# Altium project forwardConverterPCB.PrjPcb (part 8 of 22)
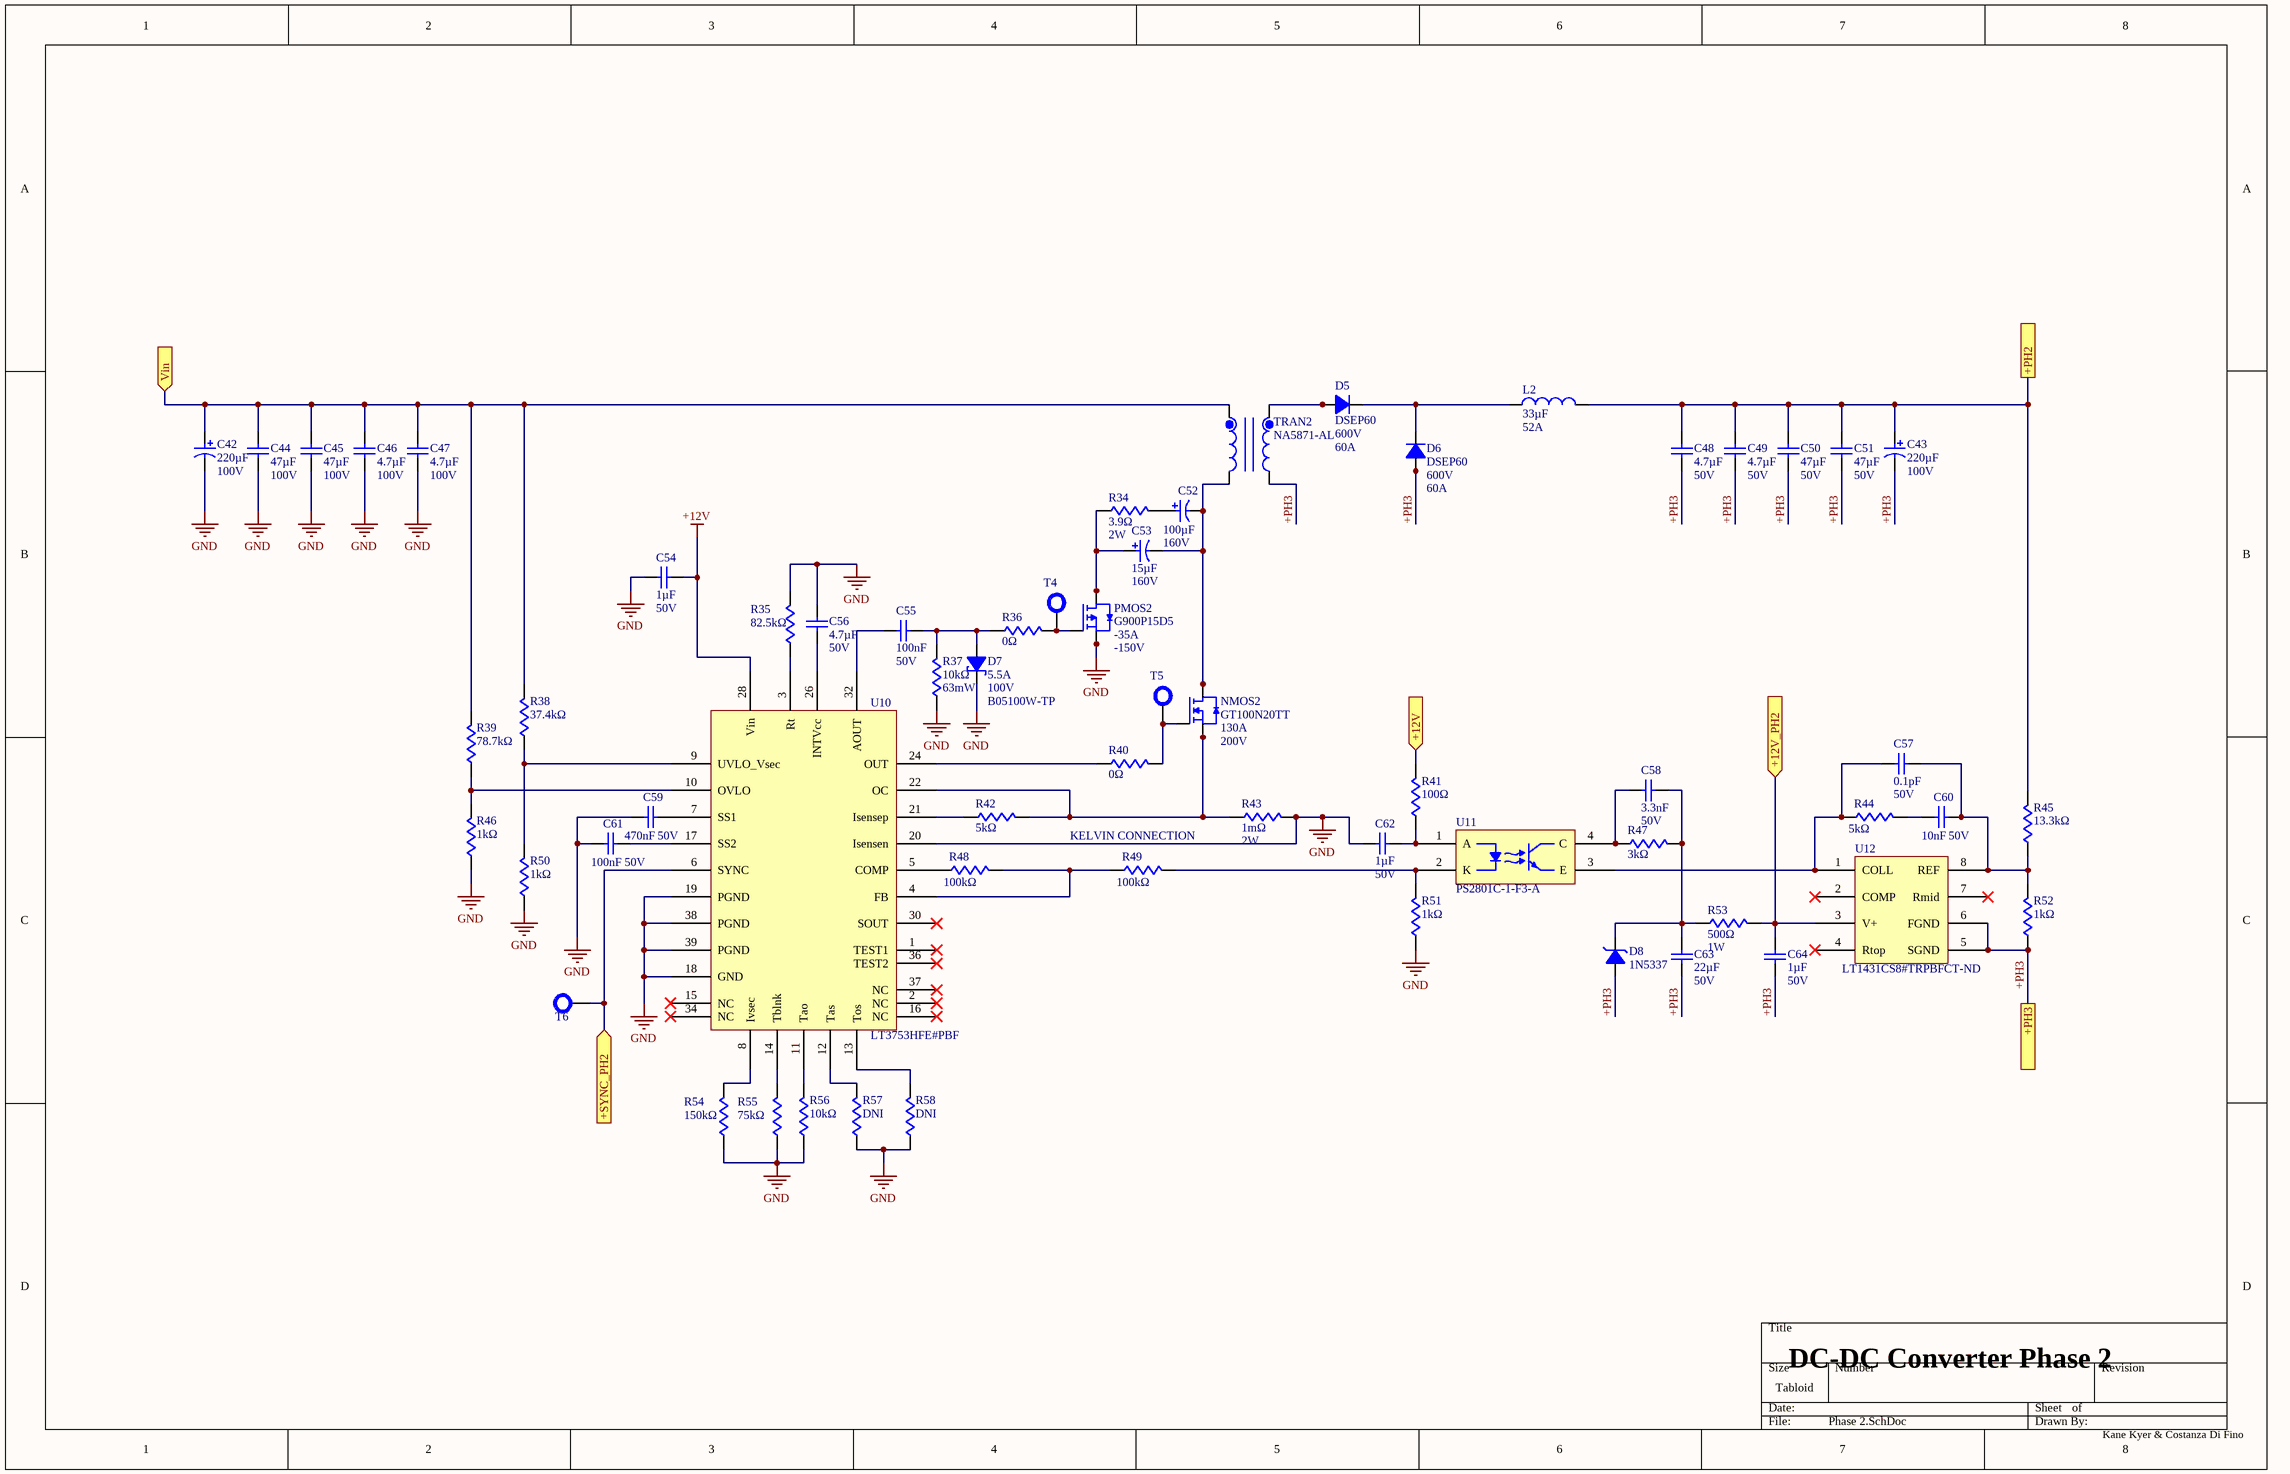
[diagram p13: Phase 2.SchDoc]

## Sheet Phase 2.SchDoc (continued)

### Library data of the parts (continued)
C60 = C0603C103K5RACTU: Capacitor, Multilayer, Ceramic, 50V, 10%, X7R, 15% Tc, 0.01Uf, Surface Mount, 0603; Manufacturer: KEMET; Dissipation Factor: 2.5%; Temperature Coefficient: 30ppm/°C; Supplier: DigiKey; Supplier Part Number: 399-C0603C103K5RACTUCT-ND; Manufacturer Part Number: C0603C103K5RACTU; RoHS: Compliant; Category: Ceramic Capacitors; Stock: 5424360; Pricing: 1=0.08, 10=0.009 (USD); Case/Package: 0603; Case Code (Imperial): 0603; China RoHS: Compliant; Contact Plating: Tin; Country of Origin: Mainland China, Mexico; Depth: 800µm; Dielectric: X7R; Dielectric Material: Ceramic; Export Control Classification Number (ECCN) Code: EAR99; Height: 800µm; Harmonized Tariff Schedule (HTS) Code: 8532.24.00.20; Introduction Date: 2011-07-27; Lead Free: Lead Free; Lead Pitch: 700µm; Length: 1.6mm; Lifecycle Status: Production; Material: Ceramic; Max Operating Temperature: 125°C; Min Operating Temperature: -55°C; Mounting Technology: Surface Mount; Pins: 2; Number of Terminals: 2; Packaging: Cut Tape; Radiation Hardening: No; REACH SVHC: Yes; Schedule B: 8532240020, 8532240020|8532240020, 8532240020|8532240020|8532240020, 8532240020|8532240020|8532240020|8532240020; Termination: SMD/SMT; Thickness: 863.6µm; Tolerance: 10%; Voltage: 50V; Voltage Rating (DC): 50V; Width: 800µm; ComponentLink1URL: https://datasheet.octopart.com:443/C0603C103K5RACTU-KEMET-datasheet-178445679.pdf?src-supplier=Farnell; ComponentLink1Description: https://datasheet.octopart.com:443/C0603C103K5RACTU-KEMET-datasheet-178445679.pdf?src-supplier=Farnell; ComponentLink2URL: https://datasheet.octopart.com:443/C0603C103K5RACTU-KEMET-datasheet-137357759.pdf?src-supplier=Farnell; ComponentLink2Description: https://datasheet.octopart.com:443/C0603C103K5RACTU-KEMET-datasheet-137357759.pdf?src-supplier=Farnell; ComponentLink3URL: https://datasheet.octopart.com:443/C0603C103K5RACTU-KEMET-datasheet-149521831.pdf?src-supplier=Farnell; ComponentLink3Description: https://datasheet.octopart.com:443/C0603C103K5RACTU-KEMET-datasheet-149521831.pdf?src-supplier=Farnell; ComponentLink4URL: https://datasheet.octopart.com:443/C0603C103K5RAC-TU-Kemet-datasheet-12608295.pdf?src-supplier=Farnell; ComponentLink4Description: https://datasheet.octopart.com:443/C0603C103K5RAC-TU-Kemet-datasheet-12608295.pdf?src-supplier=Farnell; ComponentLink5URL: https://datasheet.octopart.com:443/C0603C103K5RAC-TU-Kemet-datasheet-11992184.pdf?src-supplier=Farnell; ComponentLink5Description: https://datasheet.octopart.com:443/C0603C103K5RAC-TU-Kemet-datasheet-11992184.pdf?src-supplier=Farnell; ComponentLink6URL: https://datasheet.octopart.com:443/C0603C103K5RAC-TU-Kemet-datasheet-10942409.pdf?src-supplier=Farnell; ComponentLink6Description: https://datasheet.octopart.com:443/C0603C103K5RAC-TU-Kemet-datasheet-10942409.pdf?src-supplier=Farnell; ComponentLink7URL: https://datasheet.octopart.com:443/C0603C103K5RAC-TU-Kemet-datasheet-10404442.pdf?src-supplier=Farnell; ComponentLink7Description: https://datasheet.octopart.com:443/C0603C103K5RAC-TU-Kemet-datasheet-10404442.pdf?src-supplier=Farnell; ComponentLink8URL: https://datasheet.octopart.com:443/C0603C103K5RACTU-KEMET-datasheet-101575646.pdf?src-supplier=Farnell; ComponentLink8Description: https://datasheet.octopart.com:443/C0603C103K5RACTU-KEMET-datasheet-101575646.pdf?src-supplier=Farnell; ComponentLink9URL: https://datasheet.octopart.com:443/C0603C103K5RACTU.-Kemet-datasheet-41232427.pdf?src-supplier=Farnell; ComponentLink9Description: https://datasheet.octopart.com:443/C0603C103K5RACTU.-Kemet-datasheet-41232427.pdf?src-supplier=Farnell; ComponentLink10URL: https://datasheet.octopart.com:443/C0603C103K5RACTU-KEMET-datasheet-176142155.pdf?src-supplier=Farnell; ComponentLink10Description: https://datasheet.octopart.com:443/C0603C103K5RACTU-KEMET-datasheet-176142155.pdf?src-supplier=Farnell; ComponentLink11URL: https://datasheet.octopart.com:443/C0603C103K5RAC-TU-Kemet-datasheet-7833651.pdf?src-supplier=Farnell; ComponentLink11Description: https://datasheet.octopart.com:443/C0603C103K5RAC-TU-Kemet-datasheet-7833651.pdf?src-supplier=Farnell; ComponentLink12URL: https://datasheet.octopart.com:443/C0603C103K5RAC-TU-Kemet-datasheet-7601896.pdf?src-supplier=Farnell; ComponentLink12Description: https://datasheet.octopart.com:443/C0603C103K5RAC-TU-Kemet-datasheet-7601896.pdf?src-supplier=Farnell; ComponentLink13URL: https://datasheet.octopart.com:443/C0603C103K5RAC-TU-Kemet-datasheet-5316294.pdf?src-supplier=Farnell; ComponentLink13Description: https://datasheet.octopart.com:443/C0603C103K5RAC-TU-Kemet-datasheet-5316294.pdf?src-supplier=Farnell; ComponentLink14URL: https://datasheet.octopart.com:443/C0603C103K5RAC-TU-Kemet-datasheet-5314837.pdf?src-supplier=Farnell; ComponentLink14Description: https://datasheet.octopart.com:443/C0603C103K5RAC-TU-Kemet-datasheet-5314837.pdf?src-supplier=Farnell; ComponentLink15URL: https://datasheet.octopart.com:443/C0603C103K5RAC-TU-Kemet-datasheet-8092359.pdf?src-supplier=Farnell; ComponentLink15Description: https://datasheet.octopart.com:443/C0603C103K5RAC-TU-Kemet-datasheet-8092359.pdf?src-supplier=Farnell; ComponentLink16URL: https://datasheet.octopart.com:443/C0603C103K5RACTU-Kemet-datasheet-5314449.pdf?src-supplier=Farnell; ComponentLink16Description: https://datasheet.octopart.com:443/C0603C103K5RACTU-Kemet-datasheet-5314449.pdf?src-supplier=Farnell; ComponentLink17URL: https://datasheet.octopart.com:443/C0603C103K5RAC-TU-Kemet-datasheet-5390537.pdf?src-supplier=Farnell; ComponentLink17Description: https://datasheet.octopart.com:443/C0603C103K5RAC-TU-Kemet-datasheet-5390537.pdf?src-supplier=Farnell; ComponentLink18URL: https://datasheet.octopart.com:443/C0603C103K5RAC-TU-Kemet-datasheet-5314969.pdf?src-supplier=Farnell; ComponentLink18Description: https://datasheet.octopart.com:443/C0603C103K5RAC-TU-Kemet-datasheet-5314969.pdf?src-supplier=Farnell; ComponentLink19URL: https://datasheet.octopart.com:443/C0603C103K5RAC-TU-Kemet-datasheet-5314627.pdf?src-supplier=Farnell; ComponentLink19Description: https://datasheet.octopart.com:443/C0603C103K5RAC-TU-Kemet-datasheet-5314627.pdf?src-supplier=Farnell; ComponentLink20URL: https://datasheet.octopart.com:443/C0603C103K5RAC-TU-Kemet-datasheet-5389132.pdf?src-supplier=Farnell; ComponentLink20Description: https://datasheet.octopart.com:443/C0603C103K5RAC-TU-Kemet-datasheet-5389132.pdf?src-supplier=Farnell; ComponentLink21URL: https://datasheet.octopart.com:443/C0603C103K5RAC-TU-Kemet-datasheet-5313836.pdf?src-supplier=Farnell; ComponentLink21Description: https://datasheet.octopart.com:443/C0603C103K5RAC-TU-Kemet-datasheet-5313836.pdf?src-supplier=Farnell; ComponentLink22URL: https://datasheet.octopart.com:443/C0603C103K5RAC-TU-Kemet-datasheet-8111010.pdf?src-supplier=Farnell; ComponentLink22Description: https://datasheet.octopart.com:443/C0603C103K5RAC-TU-Kemet-datasheet-8111010.pdf?src-supplier=Farnell; ComponentLink23URL: https://datasheet.octopart.com:443/C0603C103K5RAC-TU-Kemet-datasheet-7541751.pdf?src-supplier=Farnell; ComponentLink23Description: https://datasheet.octopart.com:443/C0603C103K5RAC-TU-Kemet-datasheet-7541751.pdf?src-supplier=Farnell; ComponentLink24URL: https://datasheet.octopart.com:443/C0603C103K5RAC-TU-Kemet-datasheet-7627733.pdf?src-supplier=Farnell; ComponentLink24Description: https://datasheet.octopart.com:443/C0603C103K5RAC-TU-Kemet-datasheet-7627733.pdf?src-supplier=Farnell; ComponentLink25URL: https://datasheet.octopart.com:443/C0603C103K5RAC-TU-Kemet-datasheet-5315946.pdf?src-supplier=Farnell; ComponentLink25Description: https://datasheet.octopart.com:443/C0603C103K5RAC-TU-Kemet-datasheet-5315946.pdf?src-supplier=Farnell; ComponentLink26URL: https://datasheet.octopart.com:443/C0603C103K5RAC7867-KEMET-datasheet-182039592.pdf?src-supplier=JRH+Electronics; ComponentLink26Description: https://datasheet.octopart.com:443/C0603C103K5RAC7867-KEMET-datasheet-182039592.pdf?src-supplier=JRH+Electronics; ComponentLink27URL: https://datasheet.octopart.com:443/C0603C103K5RACTU-KEMET-datasheet-137357764.pdf?src-supplier=Upverter; ComponentLink27Description: https://datasheet.octopart.com:443/C0603C103K5RACTU-KEMET-datasheet-137357764.pdf?src-supplier=Upverter; ComponentLink28URL: https://datasheet.octopart.com:443/C0603C103K5RAC7867-KEMET-datasheet-188512054.pdf?src-supplier=ODG+(Origin+Data+Global); ComponentLink28Description: https://datasheet.octopart.com:443/C0603C103K5RAC7867-KEMET-datasheet-188512054.pdf?src-supplier=ODG+(Origin+Data+Global); ComponentLink29URL: https://datasheet.octopart.com:443/C0603C103K5RACTU-Kemet-datasheet-5313890.pdf?src-supplier=element14; ComponentLink29Description: https://datasheet.octopart.com:443/C0603C103K5RACTU-Kemet-datasheet-5313890.pdf?src-supplier=element14; ComponentLink30URL: https://datasheet.octopart.com:443/C0603C103K5RACTU-KEMET-datasheet-157246124.pdf?src-supplier=Electro+Sonic; ComponentLink30Description: https://datasheet.octopart.com:443/C0603C103K5RACTU-KEMET-datasheet-157246124.pdf?src-supplier=Electro+Sonic; ComponentLink31URL: https://datasheet.octopart.com:443/C0603C103K5RACTU-KEMET-datasheet-32036385.pdf?src-supplier=Electro+Sonic; ComponentLink31Description: https://datasheet.octopart.com:443/C0603C103K5RACTU-KEMET-datasheet-32036385.pdf?src-supplier=Electro+Sonic; ComponentLink32URL: https://datasheet.octopart.com:443/C0603C103K5RACTU-KEMET-datasheet-176142164.pdf?src-supplier=Newark; ComponentLink32Description: https://datasheet.octopart.com:443/C0603C103K5RACTU-KEMET-datasheet-176142164.pdf?src-supplier=Newark; ComponentLink33URL: https://datasheet.octopart.com:443/C0603C103K5RACTU-Kemet-datasheet-27203261.pdf?src-supplier=Newark; ComponentLink33Description: https://datasheet.octopart.com:443/C0603C103K5RACTU-Kemet-datasheet-27203261.pdf?src-supplier=Newark; ComponentLink34URL: https://datasheet.octopart.com:443/C0603C103K5RACTU-KEMET-datasheet-164512540.pdf?src-supplier=TME; ComponentLink34Description: https://datasheet.octopart.com:443/C0603C103K5RACTU-KEMET-datasheet-164512540.pdf?src-supplier=TME; ComponentLink35URL: https://datasheet.octopart.com:443/C0603C103K5RACTU-KEMET-datasheet-81639432.pdf?src-supplier=TME; ComponentLink35Description: https://datasheet.octopart.com:443/C0603C103K5RACTU-KEMET-datasheet-81639432.pdf?src-supplier=TME; ComponentLink36URL: https://datasheet.octopart.com:443/C0603C103K5RACTU-KEMET-datasheet-68331906.pdf?src-supplier=TME; ComponentLink36Description: https://datasheet.octopart.com:443/C0603C103K5RACTU-KEMET-datasheet-68331906.pdf?src-supplier=TME; ComponentLink37URL: https://datasheet.octopart.com:443/C0603C103K5RACTU-KEMET-datasheet-110724412.pdf?src-supplier=RS+(Formerly+Allied+Electronics); ComponentLink37Description: https://datasheet.octopart.com:443/C0603C103K5RACTU-KEMET-datasheet-110724412.pdf?src-supplier=RS+(Formerly+Allied+Electronics); ComponentLink38URL: https://datasheet.octopart.com:443/C0603C103K5RACTU-Kemet-datasheet-464.pdf?src-supplier=RS+(Formerly+Allied+Electronics); ComponentLink38Description: https://datasheet.octopart.com:443/C0603C103K5RACTU-Kemet-datasheet-464.pdf?src-supplier=RS+(Formerly+Allied+Electronics); ComponentLink39URL: https://datasheet.octopart.com/C0603C103K5RACTU-KEMET-datasheet-84169754.pdf; ComponentLink39Description: https://datasheet.octopart.com/C0603C103K5RACTU-KEMET-datasheet-84169754.pdf; ComponentLink40URL: https://datasheet.octopart.com:443/C0603C103K5RACTU-Kemet-datasheet-22084244.pdf?src-supplier=element14+APAC; ComponentLink40Description: https://datasheet.octopart.com:443/C0603C103K5RACTU-Kemet-datasheet-22084244.pdf?src-supplier=element14+APAC; ComponentLink41URL: https://datasheet.octopart.com:443/C0603C103K5RACTU-Kemet-datasheet-11898999.pdf?src-supplier=Arrow+Electronics; ComponentLink41Description: https://datasheet.octopart.com:443/C0603C103K5RACTU-Kemet-datasheet-11898999.pdf?src-supplier=Arrow+Electronics; ComponentLink42URL: https://datasheet.octopart.com:443/C0603C103K5RAC7867-KEMET-datasheet-164857143.pdf?src-supplier=Burklin+Elektronik; ComponentLink42Description: https://datasheet.octopart.com:443/C0603C103K5RAC7867-KEMET-datasheet-164857143.pdf?src-supplier=Burklin+Elektronik
C63 = GMC55X7R226M50NT: Ceramic Capacitor, Multilayer, Ceramic, 50V, 20% +Tol, 20% -Tol, X7R, 15% TC, 22uF, Surface Mount, 2220; Manufacturer: Cal-Chip Electronics; Supplier: DigiKey; Supplier Part Number: 4713-GMC55X7R226M50NTCT-ND; Manufacturer Part Number: GMC55X7R226M50NT; RoHS: Compliant; Category: Ceramic Capacitors; Stock: 13242; Pricing: 1=4.63, 10=3.331, 50=2.8128, 100=2.6525 (USD); China RoHS: Compliant; Dielectric Material: Ceramic; Height: 2.8mm; Length: 5.7mm; Lifecycle Status: Production; Max Operating Temperature: 125°C; Min Operating Temperature: -55°C; Mounting Technology: Surface Mount; Number of Terminals: 2; REACH SVHC: Yes; Width: 5mm; ComponentLink1URL: https://datasheet.octopart.com:443/GMC55X7R226M50NT-Cal-Chip-Electronics-datasheet-182028815.pdf?src-supplier=IHS; ComponentLink1Description: https://datasheet.octopart.com:443/GMC55X7R226M50NT-Cal-Chip-Electronics-datasheet-182028815.pdf?src-supplier=IHS
D5 D6 = DSEP60-06AZ-TRL: Power Diode Discretes-FRED TO-; Manufacturer: IXYS; Supplier: DigiKey; Supplier Part Number: 238-DSEP60-06AZ-TRLCT-ND; Manufacturer Part Number: DSEP60-06AZ-TRL; Category: Uncategorized
D7 = B05100W-TP: Rectifier Diode, Schottky, 1 Phase, 1 Element, 0.5A, 100V V(RRM), Silicon; Manufacturer: MCC; Forward Voltage: 850mV; Max Output current: 500mA; Number of Elements: 1; Peak Reverse Current: 1µA; Supplier: DigiKey; RoHS: Compliant; Category: Rectifier Diodes; Stock: 29694; Pricing: 1=0.23, 10=0.139, 100=0.0859, 500=0.06288, 1000=0.05541 (USD); China RoHS: Compliant; Lifecycle Status: Production; Max Operating Temperature: 150°C; Min Operating Temperature: -55°C; Number of Terminals: 2; REACH SVHC: Yes; Reverse Standoff Voltage: 100V; Manufacturer Part Number: B05100W-TP; Supplier Part Number: 353-B05100W-TPCT-ND
D8 = 1N5337BRLG: Zener Diode Single 4.7V 5% 2Ohm 5000mW 2-Pin Case 017AA-01 T/R / DIODE ZENER 4.7V 5W AXIAL; Manufacturer: onsemi; Manufacturer Lifecycle Status: ACTIVE; Forward Voltage: 1.2V; Impedance: 2Ω; Max Reverse Leakage Current: 5µA; Number of Elements: 1; Polarity: Unidirectional; Test Current: 260mA; Supplier: DigiKey; Manufacturer Part Number: 1N5337BRLG; RoHS: Compliant; Category: Zener Diodes; Stock: 3123; Pricing: 1=0.55, 10=0.381, 100=0.26, 500=0.203, 1000=0.169 (USD); Case/Package: Axial; China RoHS: Non-Compliant; Composition: Zener; Country of Origin: Mainland China; Diameter: 3.68mm; Export Control Classification Number (ECCN) Code: EAR99; Element Configuration: Single; Halogen Free: Halogen Free; Height: 6.35mm; Harmonized Tariff Schedule (HTS) Code: 8541.10.00.50; Introduction Date: 2000-06-28; Lead Free: Lead Free; Length: 8.89mm; Lifecycle Status: Production; Max Operating Temperature: 200°C; Max Power Dissipation: 5W; Min Operating Temperature: -65°C; Pins: 0; Number of Terminals: 2; Packaging: Tape and Reel; Peak Reverse Current: 5µA; Power Dissipation: 5W; Power Rating: 5W; Radiation Hardening: No; REACH SVHC: No; Reference Voltage: 4.7V; Schedule B: 8541100050, 8541100050|8541100050|8541100050|8541100050|8541100050|8541100050|8541100050|8541100050|8541100050|8541100050|8541100050|8541100050|8541100050|8541100050|8541100050|8541100050|8541100050|8541100050|8541100050|8541100050|8541100050|8541100050|8541100050|85; Tolerance: 5%; Voltage Rating (DC): 4.7V; Voltage Tolerance: 5%; Weight: 4.535924g; Width: 6.35mm; Working Voltage: 4.7V; Zener Current: 260mA; Zener Voltage: 4.7V; ComponentLink1URL: https://datasheet.octopart.com:443/1N5337BRLG-ON-Semiconductor-datasheet-141916626.pdf?src-supplier=Upverter; ComponentLink1Description: https://datasheet.octopart.com:443/1N5337BRLG-ON-Semiconductor-datasheet-141916626.pdf?src-supplier=Upverter; ComponentLink2URL: https://datasheet.octopart.com:443/1N5337BRLG-ON-Semiconductor-datasheet-33006776.pdf?src-supplier=Newark; ComponentLink2Description: https://datasheet.octopart.com:443/1N5337BRLG-ON-Semiconductor-datasheet-33006776.pdf?src-supplier=Newark; ComponentLink3URL: https://datasheet.octopart.com:443/1N5337BRLG-ON-Semiconductor-datasheet-153439.pdf?src-supplier=Farnell; ComponentLink3Description: https://datasheet.octopart.com:443/1N5337BRLG-ON-Semiconductor-datasheet-153439.pdf?src-supplier=Farnell; ComponentLink4URL: https://datasheet.octopart.com:443/1N5337BRLG-ON-Semiconductor-datasheet-10978983.pdf?src-supplier=onsemi; ComponentLink4Description: https://datasheet.octopart.com:443/1N5337BRLG-ON-Semiconductor-datasheet-10978983.pdf?src-supplier=onsemi; ComponentLink5URL: https://datasheet.octopart.com:443/1N5337BRLG-ON-Semiconductor-datasheet-10855185.pdf?src-supplier=Factory+Futures; ComponentLink5Description: https://datasheet.octopart.com:443/1N5337BRLG-ON-Semiconductor-datasheet-10855185.pdf?src-supplier=Factory+Futures; ComponentLink6URL: https://datasheet.octopart.com:443/1N5337BRLG-onsemi-datasheet-188912620.pdf?src-supplier=TME; ComponentLink6Description: https://datasheet.octopart.com:443/1N5337BRLG-onsemi-datasheet-188912620.pdf?src-supplier=TME; ComponentLink7URL: https://datasheet.octopart.com:443/1N5337BRLG-ON-Semiconductor-datasheet-149505804.pdf?src-supplier=TME; ComponentLink7Description: https://datasheet.octopart.com:443/1N5337BRLG-ON-Semiconductor-datasheet-149505804.pdf?src-supplier=TME; ComponentLink8URL: https://datasheet.octopart.com:443/1N5337BRLG-ON-Semiconductor-datasheet-102832425.pdf?src-supplier=TME; ComponentLink8Description: https://datasheet.octopart.com:443/1N5337BRLG-ON-Semiconductor-datasheet-102832425.pdf?src-supplier=TME; ComponentLink9URL: https://datasheet.octopart.com:443/1N5337BRLG-ON-Semiconductor-datasheet-49899566.pdf?src-supplier=TME; ComponentLink9Description: https://datasheet.octopart.com:443/1N5337BRLG-ON-Semiconductor-datasheet-49899566.pdf?src-supplier=TME; ComponentLink10URL: https://datasheet.octopart.com:443/1N5337BRLG-ON-Semiconductor-datasheet-14051315.pdf?src-supplier=iiiC; ComponentLink10Description: https://datasheet.octopart.com:443/1N5337BRLG-ON-Semiconductor-datasheet-14051315.pdf?src-supplier=iiiC; ComponentLink11URL: http://sigma.octopart.com:80/15540786/rohs_certificate/ON-Semiconductor-1N5337BRLG.pdf?src-supplier=Compliance+Statements; ComponentLink11Description: http://sigma.octopart.com:80/15540786/rohs_certificate/ON-Semiconductor-1N5337BRLG.pdf?src-supplier=Compliance+Statements; ComponentLink12URL: http://sigma.octopart.com:80/15672911/materials_sheet/ON-Semiconductor-1N5337BRLG.csv?src-supplier=Compliance+Statements; ComponentLink12Description: http://sigma.octopart.com:80/15672911/materials_sheet/ON-Semiconductor-1N5337BRLG.csv?src-supplier=Compliance+Statements; ComponentLink13URL: http://sigma.octopart.com:80/150599438/rohs_statement/ON-Semiconductor-1N5337BRLG.pdf?src-supplier=Compliance+Statements; ComponentLink13Description: http://sigma.octopart.com:80/150599438/rohs_statement/ON-Semiconductor-1N5337BRLG.pdf?src-supplier=Compliance+Statements; ComponentLink14URL: http://sigma.octopart.com:80/reach_statement/ON-Semiconductor-company-79.pdf?src-supplier=Compliance+Statements; ComponentLink14Description: http://sigma.octopart.com:80/reach_statement/ON-Semiconductor-company-79.pdf?src-supplier=Compliance+Statements; ComponentLink15URL: https://octopart.com:443/opatz8j6/c1?t=Xz1sLGOrf_NDlDfA2m4S454eiZ9sw-b50S9twK7tuuYS7rc-Emz6_JZZfLez07lP3XGtNbBX1pFBZz_Xy70tZ_aHCphlwGuHE84fu4unhZfheSXkZEy4n4MMaN81-2PpS8Zmh2dknBiulQapo3k7r460TA9wCwEDcSkUy4PO3oQu651kJ7xBa59zCChpiHyiWRmbwe1SNwjX2SvKKBZCsTZiwpaGZtgzmvErXznYZmx7x8-X8w1F27GzXHP-CXjNQHRuXIKGVZpxiSNmNxVjrxanr5cuKK60H9p4P0I5rwvg-UOhyWjZdihNcOhvy5nSg_X_5rj05sd8Cfpj1OhpFj-ZKnd-e4CeHtfB&src-supplier=Compliance+Statements; ComponentLink15Description: https://octopart.com:443/opatz8j6/c1?t=Xz1sLGOrf_NDlDfA2m4S454eiZ9sw-b50S9twK7tuuYS7rc-Emz6_JZZfLez07lP3XGtNbBX1pFBZz_Xy70tZ_aHCphlwGuHE84fu4unhZfheSXkZEy4n4MMaN81-2PpS8Zmh2dknBiulQapo3k7r460TA9wCwEDcSkUy4PO3oQu651kJ7xBa59zCChpiHyiWRmbwe1SNwjX2SvKKBZCsTZiwpaGZtgzmvErXznYZmx7x8-X8w1F27GzXHP-CXjNQHRuXIKGVZpxiSNmNxVjrxanr5cuKK60H9p4P0I5rwvg-UOhyWjZdihNcOhvy5nSg_X_5rj05sd8Cfpj1OhpFj-ZKnd-e4CeHtfB&src-supplier=Compliance+Statements; ComponentLink16URL: https://octopart.com:443/opatz8j6/c1?t=ylId5dEJGXwCW6nQwFmgHy7P9ivyvPBAi-iygNayQ_GTpskqx-SyvrczUikNsiVmfBE2D7v7vmLZkPaULIKIflhYawIzUqWj4aPjHy4xDPrl2xEinagzP7Sk94jsHoLNG7OTHwA6zjiQ34t6RGFMyOOd4No5rbrCbg9IGVYhIjcP1_jsWznBQ1zbBjiz7LcY5jS-5BkNK7LhvFFchlEbwXGF0EqaP809QD3p1_oe1e-ica55eCAgC4SCbdf3tpnEL-tTE_pQ7r0ZCgtrOMnNhjXAxu0B0RHaK2BnnnFGCa8HX5OVigZDkTpACZYW_lATNKUQPFvpsrQIk-HRyUXbCJPTPsbaIagLgCMJeA&src-supplier=Compliance+Statements; ComponentLink16Description: https://octopart.com:443/opatz8j6/c1?t=ylId5dEJGXwCW6nQwFmgHy7P9ivyvPBAi-iygNayQ_GTpskqx-SyvrczUikNsiVmfBE2D7v7vmLZkPaULIKIflhYawIzUqWj4aPjHy4xDPrl2xEinagzP7Sk94jsHoLNG7OTHwA6zjiQ34t6RGFMyOOd4No5rbrCbg9IGVYhIjcP1_jsWznBQ1zbBjiz7LcY5jS-5BkNK7LhvFFchlEbwXGF0EqaP809QD3p1_oe1e-ica55eCAgC4SCbdf3tpnEL-tTE_pQ7r0ZCgtrOMnNhjXAxu0B0RHaK2BnnnFGCa8HX5OVigZDkTpACZYW_lATNKUQPFvpsrQIk-HRyUXbCJPTPsbaIagLgCMJeA&src-supplier=Compliance+Statements
L2 = CPEX4141L-330MC: Fixed Ind 33UH 52A 1.88 Mohm Th; Manufacturer: Codaca; Supplier: DigiKey; Supplier Part Number: 4044-CPEX4141L-330MC-ND; Manufacturer Part Number: CPEX4141L-330MC; Category: Fixed Inductors
NMOS2 = GT100N20TT: Mosfet N-ch 200V 130A 280W Tolt; Manufacturer: GoFord; Supplier: DigiKey; Supplier Part Number: 3141-GT100N20TTCT-ND; Manufacturer Part Number: GT100N20TT; Category: MOSFETs
PMOS2 = G900P15D5: P-150V, -60A, RD(max) Less Than 80mOhm at -10V, VTH -1V to -4V, DFN5x6-8L; Manufacturer: GoFord; Manufacturer Lifecycle Status: ACTIVE; Supplier: DigiKey; Supplier Part Number: 3141-G900P15D5CT-ND; Manufacturer Part Number: G900P15D5; Category: MOSFETs; Harmonized Tariff Schedule (HTS) Code: 8541290000; Lifecycle Status: Production; ComponentLink1URL: https://datasheet.octopart.com:443/G900P15D5-GoFord-datasheet-189301024.pdf?src-supplier=GoFord; ComponentLink1Description: https://datasheet.octopart.com:443/G900P15D5-GoFord-datasheet-189301024.pdf?src-supplier=GoFord; Country of Origin: China
R34 = SMW23R9JT: SM Series 3.9 Ohm ±5 % 2 W ±200 ppm/°C Surface Mount Wirewound Resistor; Manufacturer: TE Connectivity; Manufacturer Lifecycle Status: ACTIVE; Insulation Resistance: 10GΩ; Number of Resistors: 1; Operating Supply Voltage: 300V; Tolerance: 5%; Supplier: DigiKey; Supplier Part Number: A103596DKR-ND; Manufacturer Part Number: SMW23R9JT; RoHS: Compliant; Category: Chip SMD Resistors; Stock: 48883; Pricing: 1=0.74, 10=0.48, 25=0.4084, 50=0.364, 100=0.3262, 250=0.28464, 500=0.25862, 1000=0.23651 (USD); Case/Package: 2616; Case Code (Imperial): 2616; Case Code (Metric): 6740; China RoHS: Compliant; Composition: Power resistor, Wirewound; Contact Plating: Tin; Depth: 4mm; Export Control Classification Number (ECCN) Code: EAR99; ELV: Compliant; Height: 3.55mm; Harmonized Tariff Schedule (HTS) Code: 8533.21.00.80; Introduction Date: 2009-09-28; Lead Free: Lead Free; Length: 6.7mm; Lifecycle Status: Production; Max Operating Temperature: 275°C; Max Power Dissipation: 2W; Military Standard: Not; Min Operating Temperature: -55°C; Mounting Technology: Surface Mount; Pins: 2; Number of Terminals: 2; Number of Terminations: 2; Packaging: Cut Tape; Power Dissipation: 2W; Radiation Hardening: No; REACH SVHC: Yes; Schedule B: 8533210045; Temperature Coefficient: 200ppm/°C; Termination: J-Lead, Solder; Voltage Rating: 300V; Voltage Rating (AC): 300V; Voltage Rating (DC): 300V; Width: 4mm; Working Voltage: 300V; ComponentLink1URL: https://datasheet.octopart.com:443/SMW23R9JT-TE-Connectivity-datasheet-179164154.pdf?src-supplier=IHS; ComponentLink1Description: https://datasheet.octopart.com:443/SMW23R9JT-TE-Connectivity-datasheet-179164154.pdf?src-supplier=IHS; ComponentLink2URL: https://datasheet.octopart.com:443/SMW23R9JT-TE-Connectivity-datasheet-145015610.pdf?src-supplier=IHS; ComponentLink2Description: https://datasheet.octopart.com:443/SMW23R9JT-TE-Connectivity-datasheet-145015610.pdf?src-supplier=IHS; ComponentLink3URL: https://datasheet.octopart.com:443/SMW23R9JT-TE-Connectivity-datasheet-182172488.pdf?src-supplier=IHS; ComponentLink3Description: https://datasheet.octopart.com:443/SMW23R9JT-TE-Connectivity-datasheet-182172488.pdf?src-supplier=IHS; ComponentLink4URL: https://datasheet.octopart.com:443/SMW23R9JT-TE-Connectivity-datasheet-11123698.pdf?src-supplier=JRH+Electronics; ComponentLink4Description: https://datasheet.octopart.com:443/SMW23R9JT-TE-Connectivity-datasheet-11123698.pdf?src-supplier=JRH+Electronics; ComponentLink5URL: https://datasheet.octopart.com:443/SMW23R9JT-TE-Connectivity-datasheet-11120284.pdf?src-supplier=Master+Electronics; ComponentLink5Description: https://datasheet.octopart.com:443/SMW23R9JT-TE-Connectivity-datasheet-11120284.pdf?src-supplier=Master+Electronics; ComponentLink6URL: https://datasheet.octopart.com:443/SMW23R9JT-TE-Connectivity-datasheet-62056503.pdf?src-supplier=Master+Electronics; ComponentLink6Description: https://datasheet.octopart.com:443/SMW23R9JT-TE-Connectivity-datasheet-62056503.pdf?src-supplier=Master+Electronics; ComponentLink7URL: https://datasheet.octopart.com:443/SMW23R9JT-TE-Connectivity-datasheet-11120060.pdf?src-supplier=Electro+Sonic; ComponentLink7Description: https://datasheet.octopart.com:443/SMW23R9JT-TE-Connectivity-datasheet-11120060.pdf?src-supplier=Electro+Sonic; ComponentLink8URL: https://datasheet.octopart.com:443/SMW23R9JT-TE-Connectivity---CGS-datasheet-184538732.pdf?src-supplier=Electro+Sonic; ComponentLink8Description: https://datasheet.octopart.com:443/SMW23R9JT-TE-Connectivity---CGS-datasheet-184538732.pdf?src-supplier=Electro+Sonic; ComponentLink9URL: https://sigma.octopart.com:443/14712258/technical_drawing/TE-Connectivity-SMW23R9JT.pdf?src-supplier=TE+Connectivity; ComponentLink9Description: https://sigma.octopart.com:443/14712258/technical_drawing/TE-Connectivity-SMW23R9JT.pdf?src-supplier=TE+Connectivity; ComponentLink10URL: https://datasheet.octopart.com:443/SMW23R9JT-TE-Connectivity-datasheet-499079.pdf?src-supplier=Newark; ComponentLink10Description: https://datasheet.octopart.com:443/SMW23R9JT-TE-Connectivity-datasheet-499079.pdf?src-supplier=Newark; ComponentLink11URL: https://datasheet.octopart.com:443/SMW23R9JT-TE-Connectivity-datasheet-504656.pdf?src-supplier=Newark; ComponentLink11Description: https://datasheet.octopart.com:443/SMW23R9JT-TE-Connectivity-datasheet-504656.pdf?src-supplier=Newark; ComponentLink12URL: https://datasheet.octopart.com:443/3-1676966-9-TE-Connectivity-datasheet-181556638.pdf?src-supplier=Sager+Electronics; ComponentLink12Description: https://datasheet.octopart.com:443/3-1676966-9-TE-Connectivity-datasheet-181556638.pdf?src-supplier=Sager+Electronics; ComponentLink13URL: https://datasheet.octopart.com:443/SMW23R9JT-TE-Connectivity-datasheet-20739869.pdf?src-supplier=RS+(Formerly+Allied+Electronics); ComponentLink13Description: https://datasheet.octopart.com:443/SMW23R9JT-TE-Connectivity-datasheet-20739869.pdf?src-supplier=RS+(Formerly+Allied+Electronics); ComponentLink14URL: https://datasheet.octopart.com:443/SMW23R9JT-Tyco-Electronics-datasheet-9795485.pdf?src-supplier=RS+(Formerly+Allied+Electronics); ComponentLink14Description: https://datasheet.octopart.com:443/SMW23R9JT-Tyco-Electronics-datasheet-9795485.pdf?src-supplier=RS+(Formerly+Allied+Electronics); ComponentLink15URL: http://sigma.octopart.com:80/14598768/rohs_statement/TE-Connectivity-SMW23R9JT.pdf?src-supplier=Compliance+Statements; ComponentLink15Description: http://sigma.octopart.com:80/14598768/rohs_statement/TE-Connectivity-SMW23R9JT.pdf?src-supplier=Compliance+Statements
R35 = RMCF0805FT82K5: Res Thick Film 0805 82.5K Ohm 1% 1/8W ±100ppm/°C Molded SMD SMD Paper T/R; Manufacturer: Stackpole Electronics; Max Power Dissipation: 125mW; Voltage Rating: 150V; Supplier: DigiKey; Supplier Part Number: RMCF0805FT82K5CT-ND; Manufacturer Part Number: RMCF0805FT82K5; RoHS: Compliant; Category: Chip SMD Resistors; Stock: 710592; Pricing: 1=0.1, 10=0.013, 25=0.0116, 50=0.0094, 100=0.0078, 250=0.00656 (USD); Case/Package: 0805; Case Code (Imperial): 0805; Case Code (Metric): 2012; China RoHS: Non-Compliant; Composition: Thick Film; Contact Plating: Tin; Depth: 1.25mm; Features: Automotive AEC-Q200; Height: 500µm; Length: 2.0066mm; Lifecycle Status: Production; Max Operating Temperature: 155°C; Military Standard: Not; Min Operating Temperature: -55°C; Mounting Technology: Surface Mount; Number of Terminals: 2; Number of Terminations: 2; Packaging: Cut Tape (CT); Power Dissipation: 125mW; Power Rating: 125mW; Radiation Hardening: No; REACH SVHC: Yes; Schedule B: 8533210045, 8533210045|8533210045|8533210045|8533210045|8533210045; Temperature Coefficient: 100ppm/°C; Tolerance: 1%; Width: 1.25mm; Working Voltage: 150V; ComponentLink1URL: https://datasheet.octopart.com:443/RMCF0805FT82K5-Stackpole-Electronics-datasheet-182148065.pdf?src-supplier=IHS; ComponentLink1Description: https://datasheet.octopart.com:443/RMCF0805FT82K5-Stackpole-Electronics-datasheet-182148065.pdf?src-supplier=IHS; ComponentLink2URL: https://datasheet.octopart.com:443/RMCF0805FT82K5-Stackpole-Electronics-datasheet-28504820.pdf?src-supplier=Upverter; ComponentLink2Description: https://datasheet.octopart.com:443/RMCF0805FT82K5-Stackpole-Electronics-datasheet-28504820.pdf?src-supplier=Upverter; ComponentLink3URL: https://datasheet.octopart.com:443/RMCF0805FT82K5-Stackpole-Electronics-datasheet-141193804.pdf?src-supplier=Master+Electronics; ComponentLink3Description: https://datasheet.octopart.com:443/RMCF0805FT82K5-Stackpole-Electronics-datasheet-141193804.pdf?src-supplier=Master+Electronics; ComponentLink4URL: https://datasheet.octopart.com:443/RMCF0805FT82K5-Stackpole-Electronics-datasheet-189104163.pdf?src-supplier=Master+Electronics; ComponentLink4Description: https://datasheet.octopart.com:443/RMCF0805FT82K5-Stackpole-Electronics-datasheet-189104163.pdf?src-supplier=Master+Electronics; ComponentLink5URL: https://datasheet.octopart.com:443/RMCF0805FT82K5-Stackpole-Electronics-datasheet-116606903.pdf?src-supplier=Master+Electronics; ComponentLink5Description: https://datasheet.octopart.com:443/RMCF0805FT82K5-Stackpole-Electronics-datasheet-116606903.pdf?src-supplier=Master+Electronics; ComponentLink6URL: https://datasheet.octopart.com:443/RMCF0805FT82K5-Stackpole-Electronics-datasheet-62091608.pdf?src-supplier=Stackpole+Electronics; ComponentLink6Description: https://datasheet.octopart.com:443/RMCF0805FT82K5-Stackpole-Electronics-datasheet-62091608.pdf?src-supplier=Stackpole+Electronics; ComponentLink7URL: https://datasheet.octopart.com:443/RMCF0805FT82K5-Stackpole-Electronics-datasheet-12534581.pdf?src-supplier=Stackpole+Electronics; ComponentLink7Description: https://datasheet.octopart.com:443/RMCF0805FT82K5-Stackpole-Electronics-datasheet-12534581.pdf?src-supplier=Stackpole+Electronics; ComponentLink8URL: https://datasheet.octopart.com:443/RMCF0805FT82K5-Stackpole-Electronics-datasheet-10788263.pdf?src-supplier=Stackpole+Electronics; ComponentLink8Description: https://datasheet.octopart.com:443/RMCF0805FT82K5-Stackpole-Electronics-datasheet-10788263.pdf?src-supplier=Stackpole+Electronics; ComponentLink9URL: http://sigma.octopart.com:80/15940719/materials_sheet/Stackpole-Electronics-RMCF0805FT82K5.pdf?src-supplier=Compliance+Statements; ComponentLink9Description: http://sigma.octopart.com:80/15940719/materials_sheet/Stackpole-Electronics-RMCF0805FT82K5.pdf?src-supplier=Compliance+Statements; ComponentLink10URL: http://sigma.octopart.com:80/141158211/reach_statement/Stackpole-Electronics-RMCF0805FT82K5.pdf?src-supplier=Compliance+Statements; ComponentLink10Description: http://sigma.octopart.com:80/141158211/reach_statement/Stackpole-Electronics-RMCF0805FT82K5.pdf?src-supplier=Compliance+Statements; ComponentLink11URL: http://sigma.octopart.com:80/141158212/rohs_statement/Stackpole-Electronics-RMCF0805FT82K5.pdf?src-supplier=Compliance+Statements; ComponentLink11Description: http://sigma.octopart.com:80/141158212/rohs_statement/Stackpole-Electronics-RMCF0805FT82K5.pdf?src-supplier=Compliance+Statements
R36 R40 R57 R58 = CRCW08050000Z0EA: Zero Ohm Resistor, Jumper, 0805 [2012 Metric], Thick Film, 125 mW, 2.5 A, Surface Mount Device; Manufacturer: Vishay; Manufacturer Package Identifier: CRCW0805-e3; Power Dissipation: 125mW; Temperature Coefficient: 100ppm/°C; Tolerance: 1%; Voltage Rating: 150V; Supplier: DigiKey; Supplier Part Number: 541-0.0ADKR-ND; Manufacturer Part Number: CRCW08050000Z0EA; RoHS: Compliant; Category: Chip SMD Resistors; Stock: 1183756; Pricing: 1=0.1, 10=0.022, 25=0.018, 50=0.0158, 100=0.0139, 250=0.01172, 500=0.01034, 1000=0.00918 (USD); Case/Package: 0805; Case Code (Imperial): 0805; China RoHS: Non-Compliant; Composition: Thick Film; Contact Plating: Lead, Tin; Country of Origin: Israel; Depth: 1.25mm; Export Control Classification Number (ECCN) Code: EAR99; Features: Automotive AEC-Q200; Height: 450µm; Harmonized Tariff Schedule (HTS) Code: 8533.21.00.30; Introduction Date: 2005-09-27; Lead Free: Lead Free; Length: 2mm; Lifecycle Status: Production; Max Operating Temperature: 155°C; Military Standard: Not; Min Operating Temperature: -55°C; Mounting Technology: Surface Mount; Pins: 2; Number of Terminals: 2; Number of Terminations: 2; Power Rating: 125mW; Radiation Hardening: No; REACH SVHC: Yes; Schedule B: 8533210045, 8533210045|8533210045, 8533210045|8533210045|8533210045, 8533210045|8533210045|8533210045|8533210045; Termination: SMD/SMT; Voltage Rating (DC): 150V; Weight: 5.499807mg; Width: 1.25mm; ComponentLink1URL: https://datasheet.octopart.com:443/CRCW08050000Z0EA-Vishay-datasheet-175423584.pdf?src-supplier=IHS; ComponentLink1Description: https://datasheet.octopart.com:443/CRCW08050000Z0EA-Vishay-datasheet-175423584.pdf?src-supplier=IHS; ComponentLink2URL: https://datasheet.octopart.com:443/CRCW08050000Z0EA-Vishay-datasheet-83961561.pdf?src-supplier=Newark; ComponentLink2Description: https://datasheet.octopart.com:443/CRCW08050000Z0EA-Vishay-datasheet-83961561.pdf?src-supplier=Newark; ComponentLink3URL: https://datasheet.octopart.com:443/CRCW08050000Z0EA-Vishay-datasheet-14722531.pdf?src-supplier=Newark; ComponentLink3Description: https://datasheet.octopart.com:443/CRCW08050000Z0EA-Vishay-datasheet-14722531.pdf?src-supplier=Newark; ComponentLink4URL: https://datasheet.octopart.com:443/CRCW08050000Z0EA-Vishay-datasheet-62317937.pdf?src-supplier=Newark; ComponentLink4Description: https://datasheet.octopart.com:443/CRCW08050000Z0EA-Vishay-datasheet-62317937.pdf?src-supplier=Newark; ComponentLink5URL: https://datasheet.octopart.com:443/CRCW08050000Z0EA-Vishay-datasheet-11516975.pdf?src-supplier=Newark; ComponentLink5Description: https://datasheet.octopart.com:443/CRCW08050000Z0EA-Vishay-datasheet-11516975.pdf?src-supplier=Newark; ComponentLink6URL: https://datasheet.octopart.com:443/CRCW08050000Z0EA-Vishay-datasheet-41302739.pdf?src-supplier=Newark; ComponentLink6Description: https://datasheet.octopart.com:443/CRCW08050000Z0EA-Vishay-datasheet-41302739.pdf?src-supplier=Newark; ComponentLink7URL: https://datasheet.octopart.com:443/CRCW08050000Z0EA-Vishay-datasheet-27121962.pdf?src-supplier=Newark; ComponentLink7Description: https://datasheet.octopart.com:443/CRCW08050000Z0EA-Vishay-datasheet-27121962.pdf?src-supplier=Newark; ComponentLink8URL: https://datasheet.octopart.com:443/CRCW08050000Z0EA-Vishay-datasheet-16179825.pdf?src-supplier=element14+APAC; ComponentLink8Description: https://datasheet.octopart.com:443/CRCW08050000Z0EA-Vishay-datasheet-16179825.pdf?src-supplier=element14+APAC; ComponentLink9URL: https://datasheet.octopart.com:443/CRCW08050000Z0EA-Vishay-datasheet-66077789.pdf?src-supplier=element14+APAC; ComponentLink9Description: https://datasheet.octopart.com:443/CRCW08050000Z0EA-Vishay-datasheet-66077789.pdf?src-supplier=element14+APAC; ComponentLink10URL: https://datasheet.octopart.com:443/CRCW08050000Z0EA-Vishay-datasheet-5300368.pdf?src-supplier=Future+Electronics; ComponentLink10Description: https://datasheet.octopart.com:443/CRCW08050000Z0EA-Vishay-datasheet-5300368.pdf?src-supplier=Future+Electronics; ComponentLink11URL: https://datasheet.octopart.com:443/CRCW08050000Z0EA-Vishay-datasheet-62316122.pdf?src-supplier=Future+Electronics; ComponentLink11Description: https://datasheet.octopart.com:443/CRCW08050000Z0EA-Vishay-datasheet-62316122.pdf?src-supplier=Future+Electronics; ComponentLink12URL: https://datasheet.octopart.com:443/CRCW08050000Z0EA-Vishay-datasheet-5306405.pdf?src-supplier=RS+(Formerly+Allied+Electronics); ComponentLink12Description: https://datasheet.octopart.com:443/CRCW08050000Z0EA-Vishay-datasheet-5306405.pdf?src-supplier=RS+(Formerly+Allied+Electronics); ComponentLink13URL: https://datasheet.octopart.com:443/CRCW08050000Z0EA-Vishay-Dale-datasheet-47688880.pdf?src-supplier=RS+(Formerly+Allied+Electronics); ComponentLink13Description: https://datasheet.octopart.com:443/CRCW08050000Z0EA-Vishay-Dale-datasheet-47688880.pdf?src-supplier=RS+(Formerly+Allied+Electronics); ComponentLink14URL: https://datasheet.octopart.com:443/CRCW08050000Z0EA-Vishay-datasheet-12001583.pdf?src-supplier=RS+(Formerly+Allied+Electronics); ComponentLink14Description: https://datasheet.octopart.com:443/CRCW08050000Z0EA-Vishay-datasheet-12001583.pdf?src-supplier=RS+(Formerly+Allied+Electronics); ComponentLink15URL: https://datasheet.octopart.com:443/CRCW08050000Z0EA-Vishay-datasheet-17834126.pdf?src-supplier=TME; ComponentLink15Description: https://datasheet.octopart.com:443/CRCW08050000Z0EA-Vishay-datasheet-17834126.pdf?src-supplier=TME; ComponentLink16URL: https://datasheet.octopart.com/D-CRCW-e3-Standard-Thick-Film-Chip-Resistors-Vishay-datasheet-family-64.pdf; ComponentLink16Description: https://datasheet.octopart.com/D-CRCW-e3-Standard-Thick-Film-Chip-Resistors-Vishay-datasheet-family-64.pdf; ComponentLink17URL: https://datasheet.octopart.com:443/CRCW08050000Z0EA-Vishay-datasheet-13242068.pdf?src-supplier=Farnell; ComponentLink17Description: https://datasheet.octopart.com:443/CRCW08050000Z0EA-Vishay-datasheet-13242068.pdf?src-supplier=Farnell; ComponentLink18URL: https://datasheet.octopart.com:443/CRCW08050000Z0EA-Vishay-datasheet-13195083.pdf?src-supplier=Farnell; ComponentLink18Description: https://datasheet.octopart.com:443/CRCW08050000Z0EA-Vishay-datasheet-13195083.pdf?src-supplier=Farnell; ComponentLink19URL: https://datasheet.octopart.com:443/CRCW08050000Z0EA-Vishay-datasheet-13034211.pdf?src-supplier=Farnell; ComponentLink19Description: https://datasheet.octopart.com:443/CRCW08050000Z0EA-Vishay-datasheet-13034211.pdf?src-supplier=Farnell; ComponentLink20URL: https://datasheet.octopart.com:443/CRCW08050000Z0EA-Vishay-datasheet-12600034.pdf?src-supplier=Farnell; ComponentLink20Description: https://datasheet.octopart.com:443/CRCW08050000Z0EA-Vishay-datasheet-12600034.pdf?src-supplier=Farnell; ComponentLink21URL: https://datasheet.octopart.com:443/CRCW08050000Z0EA-Vishay-datasheet-12532161.pdf?src-supplier=Farnell; ComponentLink21Description: https://datasheet.octopart.com:443/CRCW08050000Z0EA-Vishay-datasheet-12532161.pdf?src-supplier=Farnell; ComponentLink22URL: https://datasheet.octopart.com:443/CRCW08050000Z0EA-Vishay-datasheet-12517896.pdf?src-supplier=Farnell; ComponentLink22Description: https://datasheet.octopart.com:443/CRCW08050000Z0EA-Vishay-datasheet-12517896.pdf?src-supplier=Farnell; ComponentLink23URL: https://datasheet.octopart.com:443/CRCW08050000Z0EA-Vishay-datasheet-12509762.pdf?src-supplier=Farnell; ComponentLink23Description: https://datasheet.octopart.com:443/CRCW08050000Z0EA-Vishay-datasheet-12509762.pdf?src-supplier=Farnell; ComponentLink24URL: https://datasheet.octopart.com:443/CRCW08050000Z0EA-Vishay-datasheet-10322335.pdf?src-supplier=Farnell; ComponentLink24Description: https://datasheet.octopart.com:443/CRCW08050000Z0EA-Vishay-datasheet-10322335.pdf?src-supplier=Farnell; ComponentLink25URL: https://datasheet.octopart.com:443/CRCW08050000Z0EA-Vishay-datasheet-8788789.pdf?src-supplier=Farnell; ComponentLink25Description: https://datasheet.octopart.com:443/CRCW08050000Z0EA-Vishay-datasheet-8788789.pdf?src-supplier=Farnell; ComponentLink26URL: https://datasheet.octopart.com:443/CRCW08050000Z0EA-Vishay-datasheet-8361388.pdf?src-supplier=Farnell; ComponentLink26Description: https://datasheet.octopart.com:443/CRCW08050000Z0EA-Vishay-datasheet-8361388.pdf?src-supplier=Farnell; ComponentLink27URL: https://datasheet.octopart.com:443/CRCW08050000Z0EA-Vishay-datasheet-546287.pdf?src-supplier=Farnell; ComponentLink27Description: https://datasheet.octopart.com:443/CRCW08050000Z0EA-Vishay-datasheet-546287.pdf?src-supplier=Farnell; ComponentLink28URL: https://datasheet.octopart.com:443/CRCW08050000Z0EA-Vishay-datasheet-11540273.pdf?src-supplier=Arrow+Electronics; ComponentLink28Description: https://datasheet.octopart.com:443/CRCW08050000Z0EA-Vishay-datasheet-11540273.pdf?src-supplier=Arrow+Electronics; ComponentLink29URL: https://datasheet.octopart.com:443/CRCW08050000Z0EA-Vishay-datasheet-8445837.pdf?src-supplier=element14; ComponentLink29Description: https://datasheet.octopart.com:443/CRCW08050000Z0EA-Vishay-datasheet-8445837.pdf?src-supplier=element14; ComponentLink30URL: https://datasheet.octopart.com:443/CRCW08050000Z0EA-Vishay-datasheet-5377306.pdf?src-supplier=Garrett; ComponentLink30Description: https://datasheet.octopart.com:443/CRCW08050000Z0EA-Vishay-datasheet-5377306.pdf?src-supplier=Garrett; ComponentLink31URL: https://datasheet.octopart.com:443/CRCW08050000Z0EA-Vishay-datasheet-148188.pdf?src-supplier=Garrett; ComponentLink31Description: https://datasheet.octopart.com:443/CRCW08050000Z0EA-Vishay-datasheet-148188.pdf?src-supplier=Garrett; ComponentLink32URL: https://datasheet.octopart.com:443/CRCW08050000Z0EA-Vishay-datasheet-34203.pdf?src-supplier=Garrett; ComponentLink32Description: https://datasheet.octopart.com:443/CRCW08050000Z0EA-Vishay-datasheet-34203.pdf?src-supplier=Garrett; ComponentLink33URL: http://sigma.octopart.com:80/rohs_certificate/D-CRCW-e3-Standard-Thick-Film-Chip-Resistors-Vishay-family-102.pdf?src-supplier=Compliance+Statements; ComponentLink33Description: http://sigma.octopart.com:80/rohs_certificate/D-CRCW-e3-Standard-Thick-Film-Chip-Resistors-Vishay-family-102.pdf?src-supplier=Compliance+Statements; Max Power Dissipation: 125mW
R37 = RM04F1002CT: Fixed Resistor, Metal Glaze/thick Film, 0.0625W, 10000ohm, 50V, 1% +/-Tol, Surface Mount, 0402; Manufacturer: Cal-Chip Electronics; Power Dissipation: 62.5mW; Temperature Coefficient: 100ppm/°C; Supplier: DigiKey; Supplier Part Number: 4713-RM04F1002CT-ND; Manufacturer Part Number: RM04F1002CT; RoHS: Compliant; Category: Chip SMD Resistors; Stock: 357132; Pricing: 1=0.1, 10=0.015, 25=0.0108, 50=0.0086, 100=0.0068, 250=0.00512, 500=0.00418, 1000=0.00345, 5000=0.00232 (USD); Case/Package: 0402; China RoHS: Non-Compliant; Composition: Thick Film; Country of Origin: Slovenia, South Korea, Taiwan; Export Control Classification Number (ECCN) Code: EAR99; Height: 350µm; Harmonized Tariff Schedule (HTS) Code: 8533.21.00.30; Introduction Date: 1999-11-02; Lifecycle Status: Production; Max Operating Temperature: 155°C; Min Operating Temperature: -55°C; Mounting Technology: Surface Mount; Number of Terminals: 2; REACH SVHC: Yes; Tolerance: 1%; Voltage Rating: 50V; Width: 500µm; Working Voltage: 50V; ComponentLink1URL: https://datasheet.octopart.com:443/RM04F1002CT-Cal-Chip-Electronics-datasheet-182142084.pdf?src-supplier=IHS; ComponentLink1Description: https://datasheet.octopart.com:443/RM04F1002CT-Cal-Chip-Electronics-datasheet-182142084.pdf?src-supplier=IHS; ComponentLink2URL: https://datasheet.octopart.com:443/RM04F1002CT-Cal-Chip-Electronics-datasheet-159083027.pdf?src-supplier=Upverter; ComponentLink2Description: https://datasheet.octopart.com:443/RM04F1002CT-Cal-Chip-Electronics-datasheet-159083027.pdf?src-supplier=Upverter
R38 = RC0603FR-0737K4L: 100mW Thick Film Resistors 75V ±100ppm/℃ ±1% 37.4kΩ 0603 Chip Resistor - Surface Mount ROHS; Manufacturer: Yageo Group; Temperature Coefficient: 100ppm/°C; Voltage Rating (DC): 50V; Supplier: DigiKey; Supplier Part Number: 311-37.4KHRCT-ND; Manufacturer Part Number: RC0603FR-0737K4L; RoHS: Compliant; Category: Chip SMD Resistors; Stock: 104929; Pricing: 1=0.1, 10=0.007, 25=0.0068, 50=0.0062, 100=0.0057 (USD); Case/Package: 0603; Case Code (Imperial): 0603; China RoHS: Non-Compliant; Composition: Thick Film; Country of Origin: Mainland China, Taiwan; Depth: 800µm; Export Control Classification Number (ECCN) Code: EAR99; Features: Moisture Resistant; Height: 450µm; Harmonized Tariff Schedule (HTS) Code: 8533.21.00.30; Introduction Date: 2004-09-22; Lead Free: Lead Free; Length: 1.6002mm; Lifecycle Status: Production; Max Operating Temperature: 155°C; Military Standard: Not; Min Operating Temperature: -55°C; Mounting Technology: Surface Mount; Number of Terminals: 2; Number of Terminations: 2; Packaging: Tape & Reel; Power Dissipation: 100mW; Power Rating: 100mW; REACH SVHC: Yes; Schedule B: 8533210045, 8533210045|8533210045|8533210045|8533210045|8533210045; Termination: SMD/SMT; Tolerance: 1%; Voltage Rating: 75V; Width: 800µm; Working Voltage: 75V; ComponentLink1URL: https://datasheet.octopart.com:443/RC0603FR-0737K4L-Yageo-datasheet-175887523.pdf?src-supplier=Newark; ComponentLink1Description: https://datasheet.octopart.com:443/RC0603FR-0737K4L-Yageo-datasheet-175887523.pdf?src-supplier=Newark; ComponentLink2URL: https://datasheet.octopart.com:443/RC0603FR-0737K4L-Yageo-datasheet-103092701.pdf?src-supplier=Upverter; ComponentLink2Description: https://datasheet.octopart.com:443/RC0603FR-0737K4L-Yageo-datasheet-103092701.pdf?src-supplier=Upverter; ComponentLink3URL: https://datasheet.octopart.com:443/RC0603FR-0737K4L-Yageo-datasheet-8328172.pdf?src-supplier=TME; ComponentLink3Description: https://datasheet.octopart.com:443/RC0603FR-0737K4L-Yageo-datasheet-8328172.pdf?src-supplier=TME; ComponentLink4URL: https://datasheet.octopart.com:443/RC0603FR-0737K4L-Yageo-Group-datasheet-176638170.pdf?src-supplier=Future+Electronics; ComponentLink4Description: https://datasheet.octopart.com:443/RC0603FR-0737K4L-Yageo-Group-datasheet-176638170.pdf?src-supplier=Future+Electronics; ComponentLink5URL: https://datasheet.octopart.com:443/RC0603FR-0737K4L-Yageo-datasheet-164759695.pdf?src-supplier=Future+Electronics; ComponentLink5Description: https://datasheet.octopart.com:443/RC0603FR-0737K4L-Yageo-datasheet-164759695.pdf?src-supplier=Future+Electronics; ComponentLink6URL: https://datasheet.octopart.com:443/RC0603FR-0737K4L-Yageo-datasheet-137700087.pdf?src-supplier=Future+Electronics; ComponentLink6Description: https://datasheet.octopart.com:443/RC0603FR-0737K4L-Yageo-datasheet-137700087.pdf?src-supplier=Future+Electronics; ComponentLink7URL: https://datasheet.octopart.com:443/RC0603FR-0737K4L-Yageo-datasheet-15599030.pdf?src-supplier=Future+Electronics; ComponentLink7Description: https://datasheet.octopart.com:443/RC0603FR-0737K4L-Yageo-datasheet-15599030.pdf?src-supplier=Future+Electronics; ComponentLink8URL: https://datasheet.octopart.com:443/RC0603FR-0737K4L-Yageo-datasheet-12596169.pdf?src-supplier=Future+Electronics; ComponentLink8Description: https://datasheet.octopart.com:443/RC0603FR-0737K4L-Yageo-datasheet-12596169.pdf?src-supplier=Future+Electronics; ComponentLink9URL: https://datasheet.octopart.com/RC0603FR-0737K4L-Yageo-datasheet-73766026.pdf; ComponentLink9Description: https://datasheet.octopart.com/RC0603FR-0737K4L-Yageo-datasheet-73766026.pdf; ComponentLink10URL: https://datasheet.octopart.com:443/RC0603FR-0737K4L-Yageo-datasheet-118562.pdf?src-supplier=DigiKey; ComponentLink10Description: https://datasheet.octopart.com:443/RC0603FR-0737K4L-Yageo-datasheet-118562.pdf?src-supplier=DigiKey; ComponentLink11URL: http://sigma.octopart.com:80/conflict_mineral_statement/Yageo-company-3.pdf?src-supplier=Compliance+Statements; ComponentLink11Description: http://sigma.octopart.com:80/conflict_mineral_statement/Yageo-company-3.pdf?src-supplier=Compliance+Statements; ComponentLink12URL: http://sigma.octopart.com:80/rohs_statement/Yageo-company-2.pdf?src-supplier=Compliance+Statements; ComponentLink12Description: http://sigma.octopart.com:80/rohs_statement/Yageo-company-2.pdf?src-supplier=Compliance+Statements; Max Power Dissipation: 100mW